# EAGLE design I2C-Trippe-sensor (EAGLE 6.5.0)
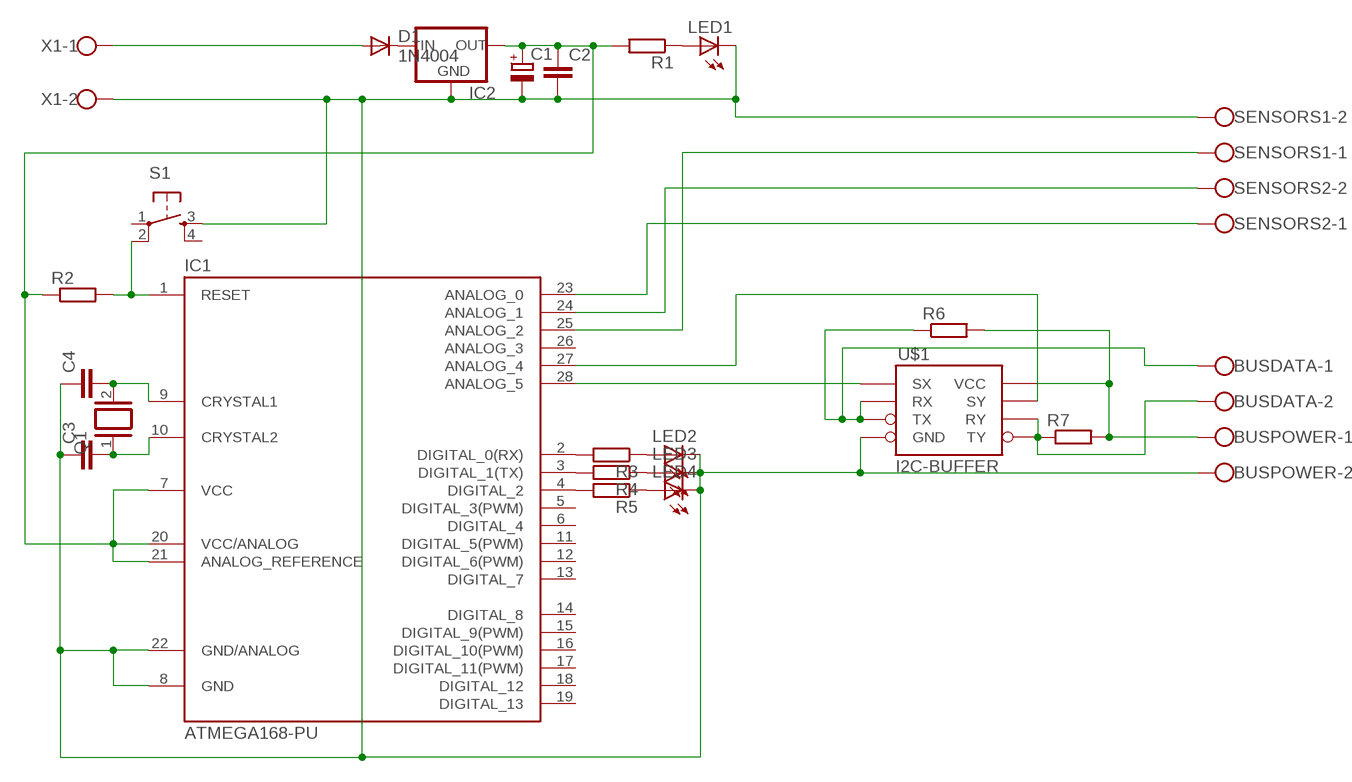
[diagram p0: schematic, sheet 1]

## Parts
BUSDATA  W237-102  [W237-102]
BUSPOWER  W237-102  [W237-102]
C1  CPOL-EUE5-10.5  [E5-10,5]
C2  C-EU050-024X044  [C050-024X044]
C3  C-EU075-032X103  [C075-032X103]
C4  C-EU075-032X103  [C075-032X103]
D1  1N4004  [DO41-10]
IC1  ATMEGA168-PU  [DIL28-3]
IC2  78XXL  [78XXL]
LED1  LED3MM  [LED3MM]
LED2  LED3MM  [LED3MM]
LED3  LED3MM  [LED3MM]
LED4  LED3MM  [LED3MM]
Q1  XTAL/S  [QS]
R1  R-EU_0207/12  [0207/12]
R2  R-EU_0207/12  [0207/12]
R3  R-EU_0207/12  [0207/12]
R4  R-EU_0207/12  [0207/12]
R5  R-EU_0207/12  [0207/12]
R6  R-EU_0207/12  [0207/12]
R7  R-EU_0207/12  [0207/12]
S1  TAC_SWITCHPTH  [TACTILE-PTH]
SENSORS1  W237-102  [W237-102]
SENSORS2  W237-102  [W237-102]
U$1  I2C-BUFFER  [I2C-BUFFER]
X1  W237-102  [W237-102]

## Nets
N$1: C4.2 IC1.9(CRYSTAL1) Q1.2
N$2: C3.2 IC1.10(CRYSTAL2) Q1.1
N$3 [Signal]: LED1.A R1.1
N$4: D1.C IC2.IN
N$5: IC1.3(DIGITAL_1(TX)) R4.2
N$6: IC1.2(DIGITAL_0(RX)) R3.2
N$7: BUSPOWER.1 R6.2 R7.2 U$1.8(VCC)
N$8: BUSDATA.2 R7.1 U$1.5(TY) U$1.6(RY)
N$9: BUSDATA.1 R6.1 U$1.2(RX) U$1.3(TX)
N$10 [Signal]: LED2.A R3.1
N$11 [Signal]: LED3.A R4.1
N$12: IC1.25(ANALOG_2) SENSORS1.1
N$13 [Signal]: C1.+ C2.1 IC1.7(VCC) IC1.20(VCC/ANALOG) IC1.21(ANALOG_REFERENCE) IC2.OUT R1.2 R2.1
N$14: D1.A X1.1
N$15: IC1.23(ANALOG_0) SENSORS2.1
N$16 [Signal]: LED4.A R5.1
N$17 [Signal]: IC1.1(RESET) R2.2 S1.2
N$18: IC1.4(DIGITAL_2) R5.2
N$23: BUSPOWER.2 C1.- C2.2 C3.1 C4.1 IC1.8(GND) IC1.22(GND/ANALOG) IC2.GND LED1.K(C) LED2.K(C) LED3.K(C) LED4.K(C) S1.3 SENSORS1.2 U$1.4(GND) X1.2
N$25: IC1.24(ANALOG_1) SENSORS2.2
N$27: IC1.28(ANALOG_5) U$1.1(SX)
N$28: IC1.27(ANALOG_4) U$1.7(SY)
Unconnected: IC1.5(DIGITAL_3(PWM)) IC1.6(DIGITAL_4) IC1.11(DIGITAL_5(PWM)) IC1.12(DIGITAL_6(PWM)) IC1.13(DIGITAL_7) IC1.14(DIGITAL_8) IC1.15(DIGITAL_9(PWM)) IC1.16(DIGITAL_10(PWM)) IC1.17(DIGITAL_11(PWM)) IC1.18(DIGITAL_12) IC1.19(DIGITAL_13) IC1.26(ANALOG_3) S1.1 S1.4

## Library data of the parts
BUSDATA BUSPOWER SENSORS1 SENSORS2 X1 = con-wago-500:W237-102: WAGO SCREW CLAMP; MPN: 237-102; OC_FARNELL: unknown; OC_NEWARK: 70K9898
C1 = resistor:CPOL-EU: POLARIZED CAPACITOR, European symbol
C2 = resistor:C-EU: CAPACITOR, European symbol
C3 C4 = rcl:C-EU: CAPACITOR, European symbol
D1 = diode:1N4004: DIODE general purpose rectifier, 1 A
IC1 = Arduino-AVR:ATMEGA168-PU
IC2 = v-reg:78XXL: VOLTAGE REGULATOR
LED1-LED4 = led:LED: LED OSRAM: - CHIPLED LG R971, LG N971, LY N971, LG Q971, LY Q971, LO R971, LY R971 LH N974, LH R974 LS Q976, LO Q976, LY Q976 LO Q996 - Hyper CHIPLED LW Q18S LB Q993, LB Q99A, LB R99A - SideLED LS A670, LO A670, LY A670, LG A670, LP A670 LB A673, LV A673, LT A673, LW A673 LH A674 LY A675 LS A676, LA A676, LO A676, LY A676, LW A676 LS A679, LY A679, LG A679 - Hyper Micro SIDELED® LS Y876, LA Y876, LO Y876, LY Y876 LT Y87S - SmartLED LW L88C, LW L88S LB L89C, LB L89S, LG L890 LS L89K, LO L89K, LY L89K LS L896, LA L896, LO L896, LY L896 - TOPLED LS T670, LO T670, LY T670, LG T670, LP T670 LSG T670, LSP T670, LSY T670, LOP T670, LYG T670 LG T671, LOG T671, LSG T671 LB T673, LV T673, LT T673, LW T673 LH T674 LS T676, LA T676, LO T676, LY T676, LB T676, LH T676, LSB T676, LW T676 LB T67C, LV T67C, LT T67C, LS T67K, LO T67K, LY T67K, LW E67C LS E67B, LA E67B, LO E67B, LY E67B, LB E67C, LV E67C, LT E67C LW T67C LS T679, LY T679, LG T679 LS T770, LO T770, LY T770, LG T770, LP T770 LB T773, LV T773, LT T773, LW T773 LH T774 LS E675, LA E675, LY E675, LS T675 LS T776, LA T776, LO T776, LY T776, LB T776 LHGB T686 LT T68C, LB T68C - Hyper Mini TOPLED® LB M676 - Mini TOPLED Santana® LG M470 LS M47K, LO M47K, LY M47K Source: http://www.osram.convergy.de LUXEON: - LUMILED® LXK2-PW12-R00, LXK2-PW12-S00, LXK2-PW14-U00, LXK2-PW14-V00 LXK2-PM12-R00, LXK2-PM12-S00, LXK2-PM14-U00 LXK2-PE12-Q00, LXK2-PE12-R00, LXK2-PE12-S00, LXK2-PE14-T00, LXK2-PE14-U00 LXK2-PB12-K00, LXK2-PB12-L00, LXK2-PB12-M00, LXK2-PB14-N00, LXK2-PB14-P00, LXK2-PB14-Q00 LXK2-PR12-L00, LXK2-PR12-M00, LXK2-PR14-Q00, LXK2-PR14-R00 LXK2-PD12-Q00, LXK2-PD12-R00, LXK2-PD12-S00 LXK2-PH12-R00, LXK2-PH12-S00 LXK2-PL12-P00, LXK2-PL12-Q00, LXK2-PL12-R00 Source: www.luxeon.com KINGBRIGHT: KA-3528ASYC Source: www.kingbright.com
Q1 = special:XTAL/S: CRYSTAL
R1-R7 = resistor:R-EU_: RESISTOR, European symbol
S1 = SparkFun-Electromechanical:TAC_SWITCH: Momentary Switch Button commonly used for reset or general input. Spark Fun Electronics SKU : COM-00097 SMT- SWCH-08247
U$1 = Custom:I2C-BUFFER

## Net classes
0 Power: width 1.5 mm, drill 0.5 mm, clearance 1 mm
1 Signal: width 0.75 mm, drill 0.5 mm, clearance 0.5 mm
2 Tiny signal: width 0.406 mm

## Board
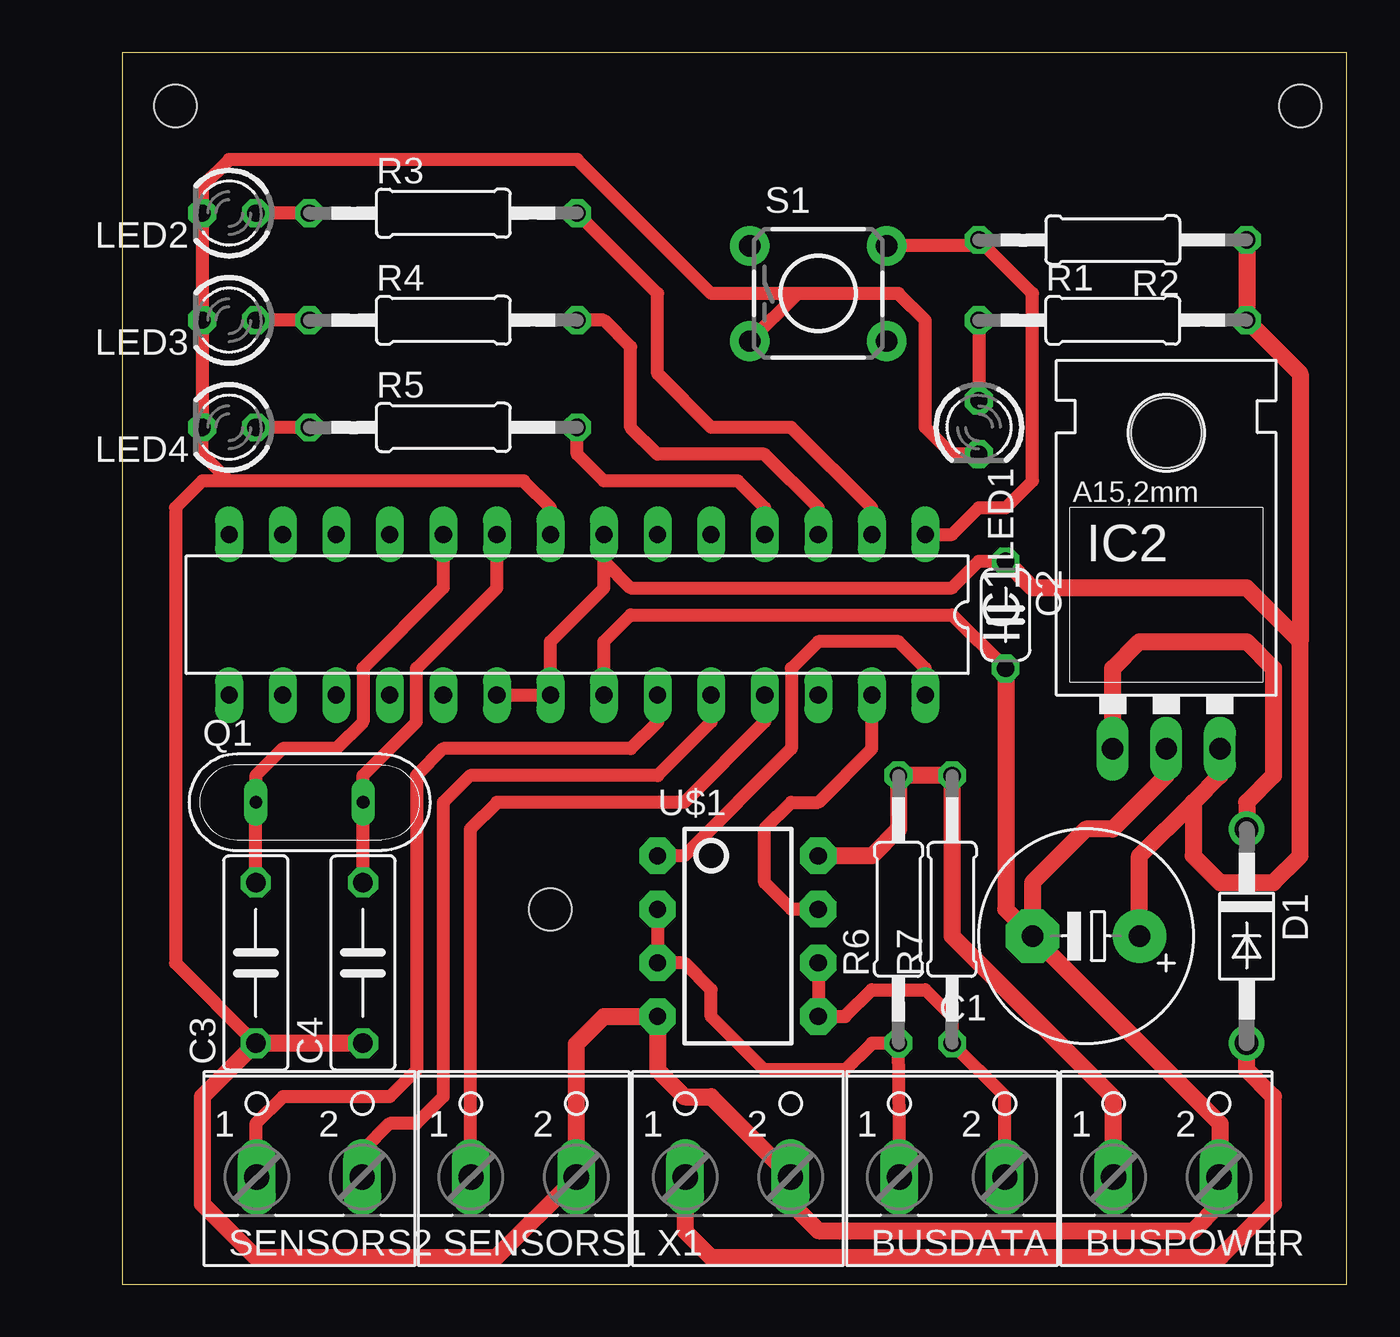
[diagram p1: board, top side]
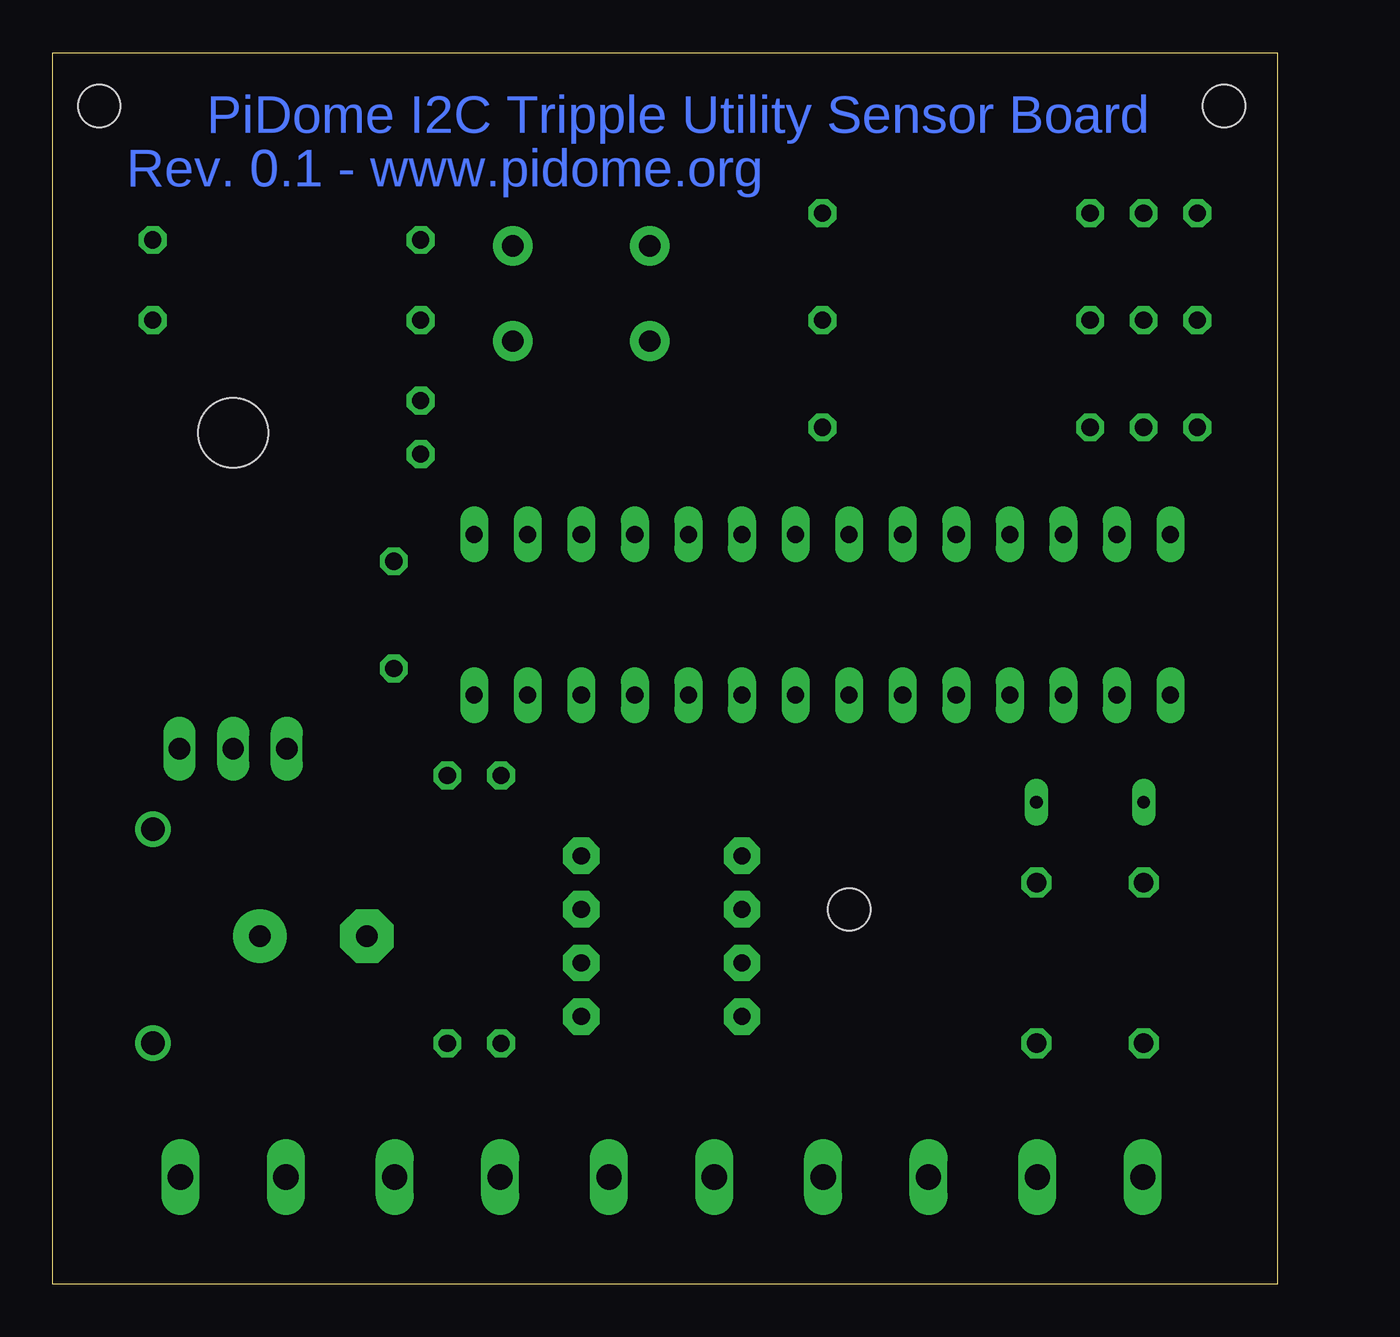
[diagram p2: board, bottom side, seen from below]

Size 58.09 x 58.41 mm. Coordinates in mm from the lower left corner, seen from the top.
Outline: 0,0 58.09,0 58.09,58.41 0,58.41 0,0
Copper layers (1*16): Top 0.035mm / dielectric 1.5mm / Bottom 0.035mm
Design rules "default": minimum track width 10mil, minimum drill 24mil, track to track 8mil, track to pad 8mil, pad to pad 8mil, via to via 8mil, smd to smd 8mil, copper to edge 40mil, drill to drill 8mil, minimum pad ring 10mil, minimum via ring 8mil, stop-mask expansion 4mil, vias tented up to drill 0mil, thermal gap 10mil
Holes 2 mm at 2.54,55.88 55.88,55.88 20.32,17.78

### Footprints (pad centres in the part's own frame; a part is rotated, then mirrored left to right if it is on the bottom)
W237-102 = drill 1.194 long: 1 -2.5,-1.27; 2 2.5,-1.27
E5-10,5 = drill 1.016 pad 2.54: + -2.54,0 | drill 1.016 pad 2.54 octagon: - 2.54,0
C050-024X044 = drill 0.813 octagon: 1 -2.54,0; 2 2.54,0
C075-032X103 = drill 0.914 octagon: 1 -3.81,0; 2 3.81,0
DO41-10 = drill 1.118: A 5.08,0; C -5.08,0
DIL28-3 = drill 0.813 long: 1 -16.51,-3.81; 2 -13.97,-3.81; 3 -11.43,-3.81; 4 -8.89,-3.81; 5 -6.35,-3.81; 6 -3.81,-3.81; 7 -1.27,-3.81; 8 1.27,-3.81; 9 3.81,-3.81; 10 6.35,-3.81; 11 8.89,-3.81; 12 11.43,-3.81; 13 13.97,-3.81; 14 16.51,-3.81; 15 16.51,3.81; 16 13.97,3.81; 17 11.43,3.81; 18 8.89,3.81; 19 6.35,3.81; 20 3.81,3.81; 21 1.27,3.81; 22 -1.27,3.81; 23 -3.81,3.81; 24 -6.35,3.81; 25 -8.89,3.81; 26 -11.43,3.81; 27 -13.97,3.81; 28 -16.51,3.81
78XXL = drill 1.016 long: GND 0,-3.81; IN -2.54,-3.81; OUT 2.54,-3.81 | hole 3.302: 0,11.176
LED3MM = drill 0.813 octagon: A -1.27,0; K 1.27,0
QS = drill 0.61 long: 1 -2.54,0; 2 2.54,0
0207/12 = drill 0.813 octagon: 1 -6.35,0; 2 6.35,0
TACTILE-PTH = drill 1.016 pad 1.88: 1 -3.251,2.261; 2 3.251,2.261; 3 -3.251,-2.261; 4 3.251,-2.261
I2C-BUFFER = drill 0.813 pad 1.727 octagon: 1 -2.54,-3.81; 2 0,-3.81; 3 2.54,-3.81; 4 5.08,-3.81; 5 5.08,3.81; 6 2.54,3.81; 7 0,3.81; 8 -2.54,3.81

### Placement (x,y rotation side)
BUSDATA  39.37,6.35 0 top
BUSPOWER  49.53,6.35 0 top
C1  45.72,16.51 180 top
C2  41.91,31.75 270 top
C3  6.35,15.24 90 top
C4  11.43,15.24 90 top
D1  53.34,16.51 270 top
IC1  21.59,31.75 180 top
IC2  49.53,29.21 0 top
LED1  40.64,40.64 270 top
LED2  5.08,50.8 180 top
LED3  5.08,45.72 180 top
LED4  5.08,40.64 180 top
Q1  8.89,22.86 0 top
R1  46.99,45.72 0 top
R2  46.99,49.53 180 top
R3  15.24,50.8 0 top
R4  15.24,45.72 0 top
R5  15.24,40.64 0 top
R6  36.83,17.78 90 top
R7  39.37,17.78 90 top
S1  33.02,46.99 0 top
SENSORS1  19.05,6.35 0 top
SENSORS2  8.89,6.35 0 top
U$1  29.21,17.78 270 top
X1  29.21,6.35 0 top

### Tracks (layer width: path | path; a pad name or v marks a point on that pad's centre or on a via)
N$1
  Top 0.61: C4.2 Q1.2 11.43,24.13 13.97,26.67 13.97,29.21 17.78,33.02 IC1.9
N$2
  Top 0.61: C3.2 Q1.1 6.35,24.13 7.62,25.4 10.16,25.4 11.43,26.67 11.43,29.21 15.24,33.02 IC1.10
N$3
  Top 0.61: R1.1 LED1.A
N$4
  Top 0.813: IC2.IN 46.99,29.21 48.26,30.48 53.34,30.48 54.61,29.21 54.61,24.13 53.34,22.86 D1.C
N$5
  Top 0.61: IC1.3 33.02,36.83 30.48,39.37 25.4,39.37 24.13,40.64 24.13,44.45 22.86,45.72 R4.2
N$6
  Top 0.61: IC1.2 35.56,36.83 31.75,40.64 27.94,40.64 25.4,43.18 25.4,46.99 R3.2
N$7
  Top 0.813: BUSPOWER.1 46.99,5.12 46.99,8.89 39.37,16.51 R7.2 R6.2 36.83,21.59 35.56,20.32 U$1.8
N$8
  Top 0.61: U$1.6 U$1.5 34.29,12.7 35.56,13.97 38.1,13.97 39.37,12.7 R7.1 41.87,8.93 BUSDATA.2
N$9
  Top 0.61: BUSDATA.1 36.87,7.58 R6.1 35.56,11.43 34.29,10.16 30.48,10.16 27.94,12.7 27.94,13.97 26.67,15.24 U$1.3 U$1.2
N$10
  Top 0.61: R3.1 LED2.A
N$11
  Top 0.61: R4.1 LED3.A
N$12
  Top 0.61: IC1.25 30.48,26.67 26.67,22.86 17.78,22.86 16.51,21.59 16.51,5.12 SENSORS1.1
N$13
  Top 0.61: IC1.20 IC1.21 20.32,30.48 22.86,33.02 IC1.7 22.86,34.29 24.13,33.02 39.37,33.02 40.64,34.29 C2.1
  Top 0.813: C1.+ 48.26,20.32 50.8,22.86 | IC2.OUT 52.07,24.13 50.8,22.86 | 50.8,22.86 50.8,20.32 52.07,19.05 54.61,19.05 55.88,20.32 55.88,30.48 | 55.88,30.48 53.34,33.02 43.18,33.02 C2.1 | R2.1 R1.2 55.88,43.18 55.88,30.48
N$14
  Top 0.813: X1.1 26.71,2.5 27.94,1.27 52.07,1.27 54.61,3.81 54.61,8.89 53.34,10.16 D1.A
N$15
  Top 0.61: IC1.23 25.4,26.67 24.13,25.4 15.24,25.4 13.97,24.13 13.97,10.16 12.7,8.89 7.62,8.89 6.35,7.62 6.35,5.12 SENSORS2.1
N$16
  Top 0.61: R5.1 LED4.A
N$17
  Top 0.406: 40.36,49.25 R2.2
  Top 0.61: 40.36,49.25 S1.2 | IC1.1 39.37,35.56 40.64,36.83 41.91,36.83 43.18,38.1 43.18,46.99 R2.2
N$18
  Top 0.61: IC1.4 30.48,36.83 29.21,38.1 22.86,38.1 21.59,39.37 R5.2
N$23
  Top 0.61: IC1.22 22.86,30.48 24.13,31.75 39.37,31.75 C2.2 | 5.08,38.1 3.81,39.37 LED4.K LED3.K LED2.K 3.81,52.07 5.08,53.34 21.59,53.34 27.94,46.99 32.03,46.99 | IC1.8 20.32,36.83 19.05,38.1 5.08,38.1 | 5.08,38.1 3.81,38.1 2.54,36.83 2.54,15.24 C3.1 | 32.03,46.99 36.83,46.99 38.1,45.72 38.1,40.64 39.37,39.37 LED1.K | 32.03,46.99 S1.3
  Top 0.813: IC2.GND 49.53,24.13 46.99,21.59 45.72,21.59 43.18,19.05 C1.- | C2.2 41.91,17.78 C1.- | C1.- 52.07,7.62 52.07,5.12 BUSPOWER.2 52.07,5.04 52.07,3.81 50.8,2.54 33.02,2.54 31.75,3.81 31.75,5.08 31.71,5.12 | C4.1 C3.1 3.81,8.89 3.81,3.81 6.35,1.27 17.74,1.27 SENSORS1.2 21.55,11.39 22.86,12.7 U$1.4 25.4,10.16 26.67,8.89 27.94,8.89 31.71,5.12 | X1.2 31.71,5.12
N$25
  Top 0.61: IC1.24 27.94,26.67 25.4,24.13 16.51,24.13 15.24,22.86 15.24,8.89 13.97,7.62 12.7,7.62 11.43,6.35 11.43,5.12 SENSORS2.2
N$27
  Top 0.61: IC1.28 38.1,29.21 36.83,30.48 33.02,30.48 31.75,29.21 31.75,25.4 26.67,20.32 U$1.1
N$28
  Top 0.61: U$1.7 31.75,17.78 30.48,19.05 30.48,21.59 31.75,22.86 33.02,22.86 35.56,25.4 IC1.27

### Text on the board
Bottom: PiDome I2C Tripple Utility Sensor Board | Rev. 0.1 - www.pidome.org